# EAGLE schematic LoNet800L (EAGLE 7.5.0)
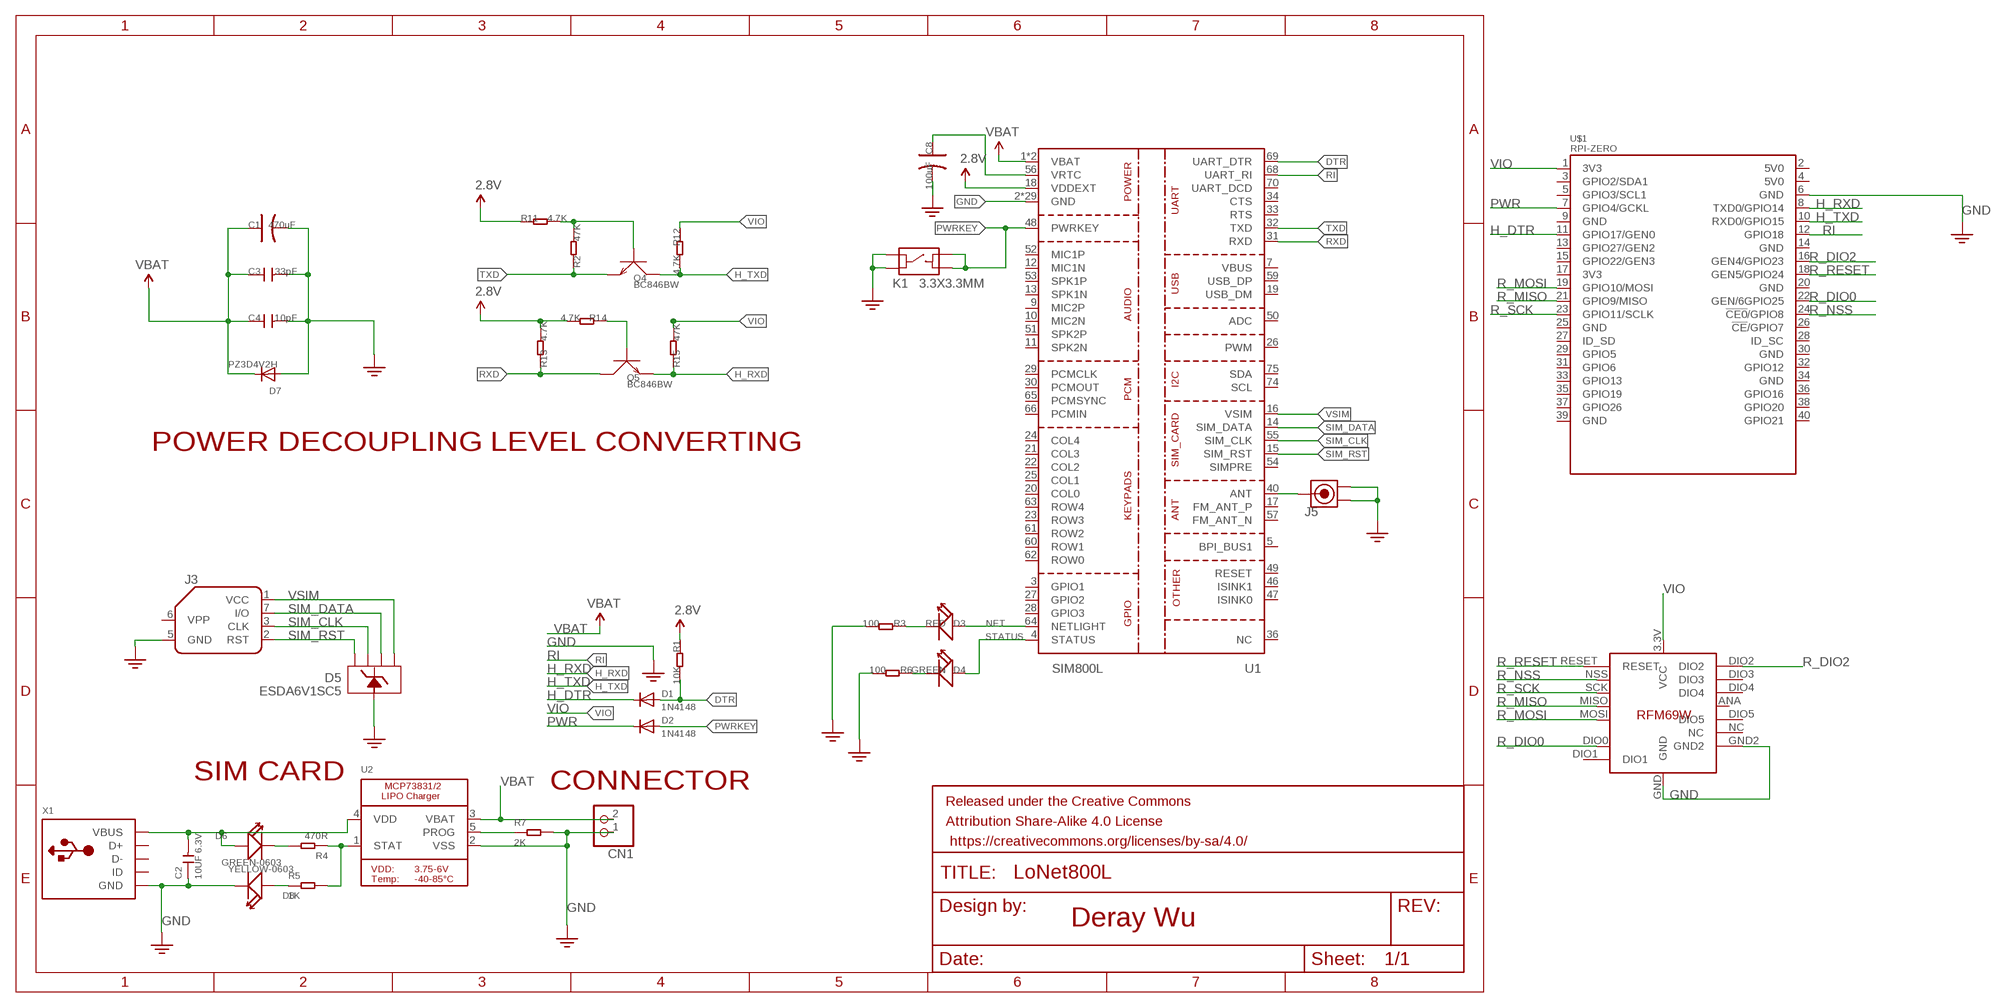
[diagram p0: schematic, sheet 1]

## Parts
C1  470uF  CAP-AVX-D  [AVX-D]
C2  10UF 6.3V  CERAMIC-10UF-6.3V-20%-X5R(0603)  [C0603]
C3  33pF  C-0603  [C0603]
C4  10pF  C-0603  [C0603]
C8  100uF  CAP-AVX-A  [AVX-A]
CN1  JST_2PIN  [JSTPH2]
D1  1N4148  DIODESOD-323F  [SOD-323F]
D2  1N4148  DIODESOD-323F  [SOD-323F]
D3  RED  LED-0603  [0603]
D4  GREEN  LED-0603  [0603]
D5  ESDA6V1SC5  D-ESD-ESDA6V1SC5-SOT23-5L  [SOT23-5L]
D6  YELLOW-0603  SMD-LED-CLEAR-YELLOW(0603)  [LED-0603]
D7  PZ3D4V2H  DIODESOD-323F  [SOD-323F]
D8  GREEN-0603  SMD-LED-CLEAR-GREEN(0603)  [LED-0603]
J3  SIMHOLDERSIM  [SIMHOLDER]
J5  ANTENNA-U-FL'3PAD-TYPE'  [3P-U-FL]
K1  3.3X3.3MM  BUTTON-4P-3.3X3.3  [4P-SMD-3.4X3.4X1.3H]
Q4  BC846BW  TRANSISTOR-NPN-SOT323  [SOT323]
Q5  BC846BW  TRANSISTOR-NPN-SOT323  [SOT323]
R1  10K  R-0603  [0603]
R2  47K  R-0603  [0603]
R3  100  R-0603  [0603]
R4  470R  SMD-RES-470R-5%-1/10W(0603)  [R0603]
R5  1K  SMD-RES-1K-1%-1/10W(0603)  [R0603]
R6  100  R-0603  [0603]
R7  2K  SMD-RES-2K-1%-1/10W(0603)  [R0603]
R11  4.7K  R-0603  [0603]
R12  4.7K  R-0603  [0603]
R13  4.7K  R-0603  [0603]
R14  4.7K  R-0603  [0603]
R15  47K  R-0603  [0603]
U1  SIM800L  [88P-17.8X15.8X2.4]
U2  MCP73831/2  [SOT23-5]
U$1  RPI-ZERO  [RASPBERRYPI_BASTELSTUBE_V13_RASPI_BOARD_B+_FULL]
U$2  RFM69  [RFM69W-MINPADS]
X1  USBMICRO_20329  [4UCONN_20329]

## Nets
2.8V: R1.1 R11.1 R13.2 R14.2 U1.18(VDDEXT)
ANT: J5.D U1.40(ANT)
DTR: D1.A R1.2 U1.69(UART_DTR)
GND: C1.- C2.1 C3.2 C4.2 C8.- CN1.1 D5.2 D7.A D8.- J3.5(GND) J5.GND1 J5.GND2 K1.A0 K1.A1 R3.2 R6.2 R7.2 U1.2(GND) U1.6(GND) U1.8(GND) U1.35(GND) U1.37(GND) U1.38(GND) U1.39(GND) U1.41(GND) U1.43(GND) U1.44(GND) U1.45(GND) U1.58(GND) U1.67(GND) U1.71(GND) U1.72(GND) U1.73(GND) U1.76(GND) U1.77(GND) U1.78(GND) U1.79(GND) U1.80(GND) U1.81(GND) U1.82(GND) U1.83(GND) U1.84(GND) U1.85(GND) U1.86(GND) U1.87(GND) U1.88(GND) U2.2(VSS) U$1.6(GND) U$2.GND U$2.GND2 X1.BASE@1(GND) X1.BASE@2(GND) X1.GND X1.SPRT@1(GND) X1.SPRT@2(GND) X1.SPRT@3(GND) X1.SPRT@4(GND)
H_DTR: D1.C U$1.11(GPIO17/GEN0)
H_RXD: Q5.2(E) R15.1 U$1.8(TXD0/GPIO14)
H_TXD: Q4.3(C) R12.2 U$1.10(RXD0/GPIO15)
N$1: C8.+ U1.56(VRTC)
N$3: C2.2 D6.+ U2.4(VDD) X1.VBUS
N$4: D3.- R3.1
N$5: D6.- R4.2
N$6: Q4.1(B) R2.2 R11.2
N$7: R4.1 R5.2 U2.1(STAT)
N$8: D4.- R6.1
N$9: Q5.1(B) R14.1
N$10: D8.+ R5.1
N$11: R7.1 U2.5(PROG)
NET: D3.+ U1.64(NETLIGHT)
PWR: D2.C U$1.7(GPIO4/GCKL)
PWRKEY: D2.A K1.B0 K1.B1 U1.48(PWRKEY)
R_DIO0: U$1.22(GEN/6GPIO25) U$2.DIO0
R_DIO2: U$1.16(GEN4/GPIO23) U$2.DIO2
R_MISO: U$1.21(GPIO9/MISO) U$2.MISO
R_MOSI: U$1.19(GPIO10/MOSI) U$2.MOSI
R_NSS: U$1.24(!CE0!/GPIO8) U$2.NSS(SEL)
R_RESET: U$1.18(GEN5/GPIO24) U$2.RESET
R_SCK: U$1.23(GPIO11/SCLK) U$2.SCK
RI: U1.68(UART_RI) U$1.12(GPIO18)
RXD: Q5.3(C) R13.1 U1.31(RXD)
SIM_CLK: D5.5 J3.3(CLK) U1.55(SIM_CLK)
SIM_DATA: D5.3 J3.7(I/O) U1.14(SIM_DATA)
SIM_RST: D5.4 J3.2(RST) U1.15(SIM_RST)
STATUS: D4.+ U1.4(STATUS)
TXD: Q4.2(E) R2.1 U1.32(TXD)
VBAT: C1.+ C3.1 C4.1 CN1.2 D7.C U1.1(VBAT) U1.42(VBAT) U2.3(VBAT)
VIO: R12.1 R15.2 U$1.1(3V3) U$2.3.3V(VCC)
VSIM: D5.1 J3.1(VCC) U1.16(VSIM)
Unconnected: J3.6(VPP) U1.3(GPIO1) U1.5(BPI_BUS1) U1.7(VBUS) U1.9(MIC2P) U1.10(MIC2N) U1.11(SPK2N) U1.12(MIC1N) U1.13(SPK1N) U1.17(FM_ANT_P) U1.19(USB_DM) U1.20(COL0) U1.21(COL3) U1.22(COL2) U1.23(ROW3) U1.24(COL4) U1.25(COL1) U1.26(PWM) U1.27(GPIO2) U1.28(GPIO3) U1.29(PCMCLK) U1.30(PCMOUT) U1.33(RTS) U1.34(CTS) U1.36(NC) U1.46(ISINK1) U1.47(ISINK0) U1.49(RESET) U1.50(ADC) U1.51(SPK2P) U1.52(MIC1P) U1.53(SPK1P) U1.54(SIMPRE) U1.57(FM_ANT_N) U1.59(USB_DP) U1.60(ROW1) U1.61(ROW2) U1.62(ROW0) U1.63(ROW4) U1.65(PCMSYNC) U1.66(PCMIN) U1.70(UART_DCD) U1.74(SCL) U1.75(SDA) U$1.2(5V0) U$1.3(GPIO2/SDA1) U$1.4(5V0) U$1.5(GPIO3/SCL1) U$1.9(GND) U$1.13(GPIO27/GEN2) U$1.14(GND) U$1.15(GPIO22/GEN3) U$1.17(3V3) U$1.20(GND) U$1.25(GND) U$1.26(!CE!/GPIO7) U$1.27(ID_SD) U$1.28(ID_SC) U$1.29(GPIO5) U$1.30(GND) U$1.31(GPIO6) U$1.32(GPIO12) U$1.33(GPIO13) U$1.34(GND) U$1.35(GPIO19) U$1.36(GPIO16) U$1.37(GPIO26) U$1.38(GPIO20) U$1.39(GND) U$1.40(GPIO21) U$2.ANA(ANT) U$2.DIO1 U$2.DIO3 U$2.DIO4 U$2.DIO5 U$2.NC X1.D+ X1.D- X1.ID

## Notes on the sheet
- POWER DECOUPLING | LEVEL CONVERTING
- SIM CARD
- CONNECTOR
- Deray Wu

## Library data of the parts
C1 = Common:CAP*
C2 = Seeed-OPL-Capacitor:CERAMIC-10UF-6.3V-20%-X5R(0603): 302010286; MPN: CC0603MRX5R5BB106
C3 C4 = Capacitors:C*
C8 = Capacitors:CAP*
CN1 = LBRmicrobuilder:JST_2PIN: JST 2-Pin Right-Angle Connector PH-Series - 4UConnector: 17311 SH-Series - 4UConnector: 07278
D1 D2 D7 = Semiconductors:DIODE: Diode SMADIODE - SMA Surface Mount Package 20V 1A Schottky Diode Digikey: 641-1014-6-ND DO-1N4148 - Through Hole Small Current Diode SOD-123 20V 1 A (.5mV Vf) Schottky Diode - Digikey: MBRX120TPMSCT-ND SOD-323 10V 570mA (.38mV Vf, 3ns) Schottky Diode - Digikey: ZLLS410CT-ND SOD-523 30V 30mA Schottky Diode (RB751S-40TE61) - Digikey: RB751S-40TE61CT-ND SOT23-R/W - SOT23 Package (R = Solder Paste/Reflow Ovens, W = Hand-Soldering) BAT54Film 40V 300mA - Digikey: 497-7162-1-ND
D3 D4 = LEDs:LED*
D5 = Semiconductors:D-ESD-ESDA6V1SC5: Quad Transil array for ESD protection STMicroelectronics http://www.st.com/internet/com/TECHNICAL_RESOURCES/TECHNICAL_LITERATURE/DATASHEET/CD00002055.pdf
D6 = Seeed-OPL-Diode:SMD-LED-CLEAR-YELLOW(0603): 304090044; MPN: 19-217-Y5C-AM1N1VY-3T
D8 = Seeed-OPL-Diode:SMD-LED-CLEAR-GREEN(0603): 304090043; MPN: 19-217-G7C-AN1P2-3T
J3 = SparkFun-Connectors:SIMHOLDER: SIM Socket Socket for SIM cellular cards. Schematic element and footprint production proven. Spark Fun Electronics SKU : PRT-00548; PROD_ID: CONN-08536
J5 = Connector:ANTENNA-U-FL
K1 = Buttons:BUTTON-4P
Q4 Q5 = Semiconductors:TRANSISTOR-NPN*: NPN audion
R1-R3 R6 R11-R15 = Resistors:R*
R4 = Seeed-OPL-Resistor:SMD-RES-470R-5%-1/10W(0603): 301010088; MPN: RC0603JR-07470RL
R5 = Seeed-OPL-Resistor:SMD-RES-1K-1%-1/10W(0603): 301010298; MPN: RC0603FR-071KL
R7 = Seeed-OPL-Resistor:SMD-RES-2K-1%-1/10W(0603): 301010221; MPN: RC0603FR-072KL
U1 = SIMCOM:SIM800L
U2 = LBRmicrobuilder:MCP73831/2: MCP73831/2 LIPO Charger VDD: 3.75 - 6V Temp -40 - 85°C Programmable Charge Rate: 15-500mA NOTE: STAT is a tri-state logic output on the MCP73831 and an open-drain output on the MCP73832. SOT23-5 with 4.2V output and tri-state logic on STAT = MCP73831T-2ACI/OT
U$1 = RPI-Zero:RPI-ZERO
U$2 = RFM69:RFM69
X1 = LBRmicrobuilder:USB: USB Connectors USBMINIB - Surface Mount Female Mini-B USB Connector 4UConnector: 06564